# EAGLE schematic openSX70-dongle-USB-V2 (EAGLE 9.2.0)
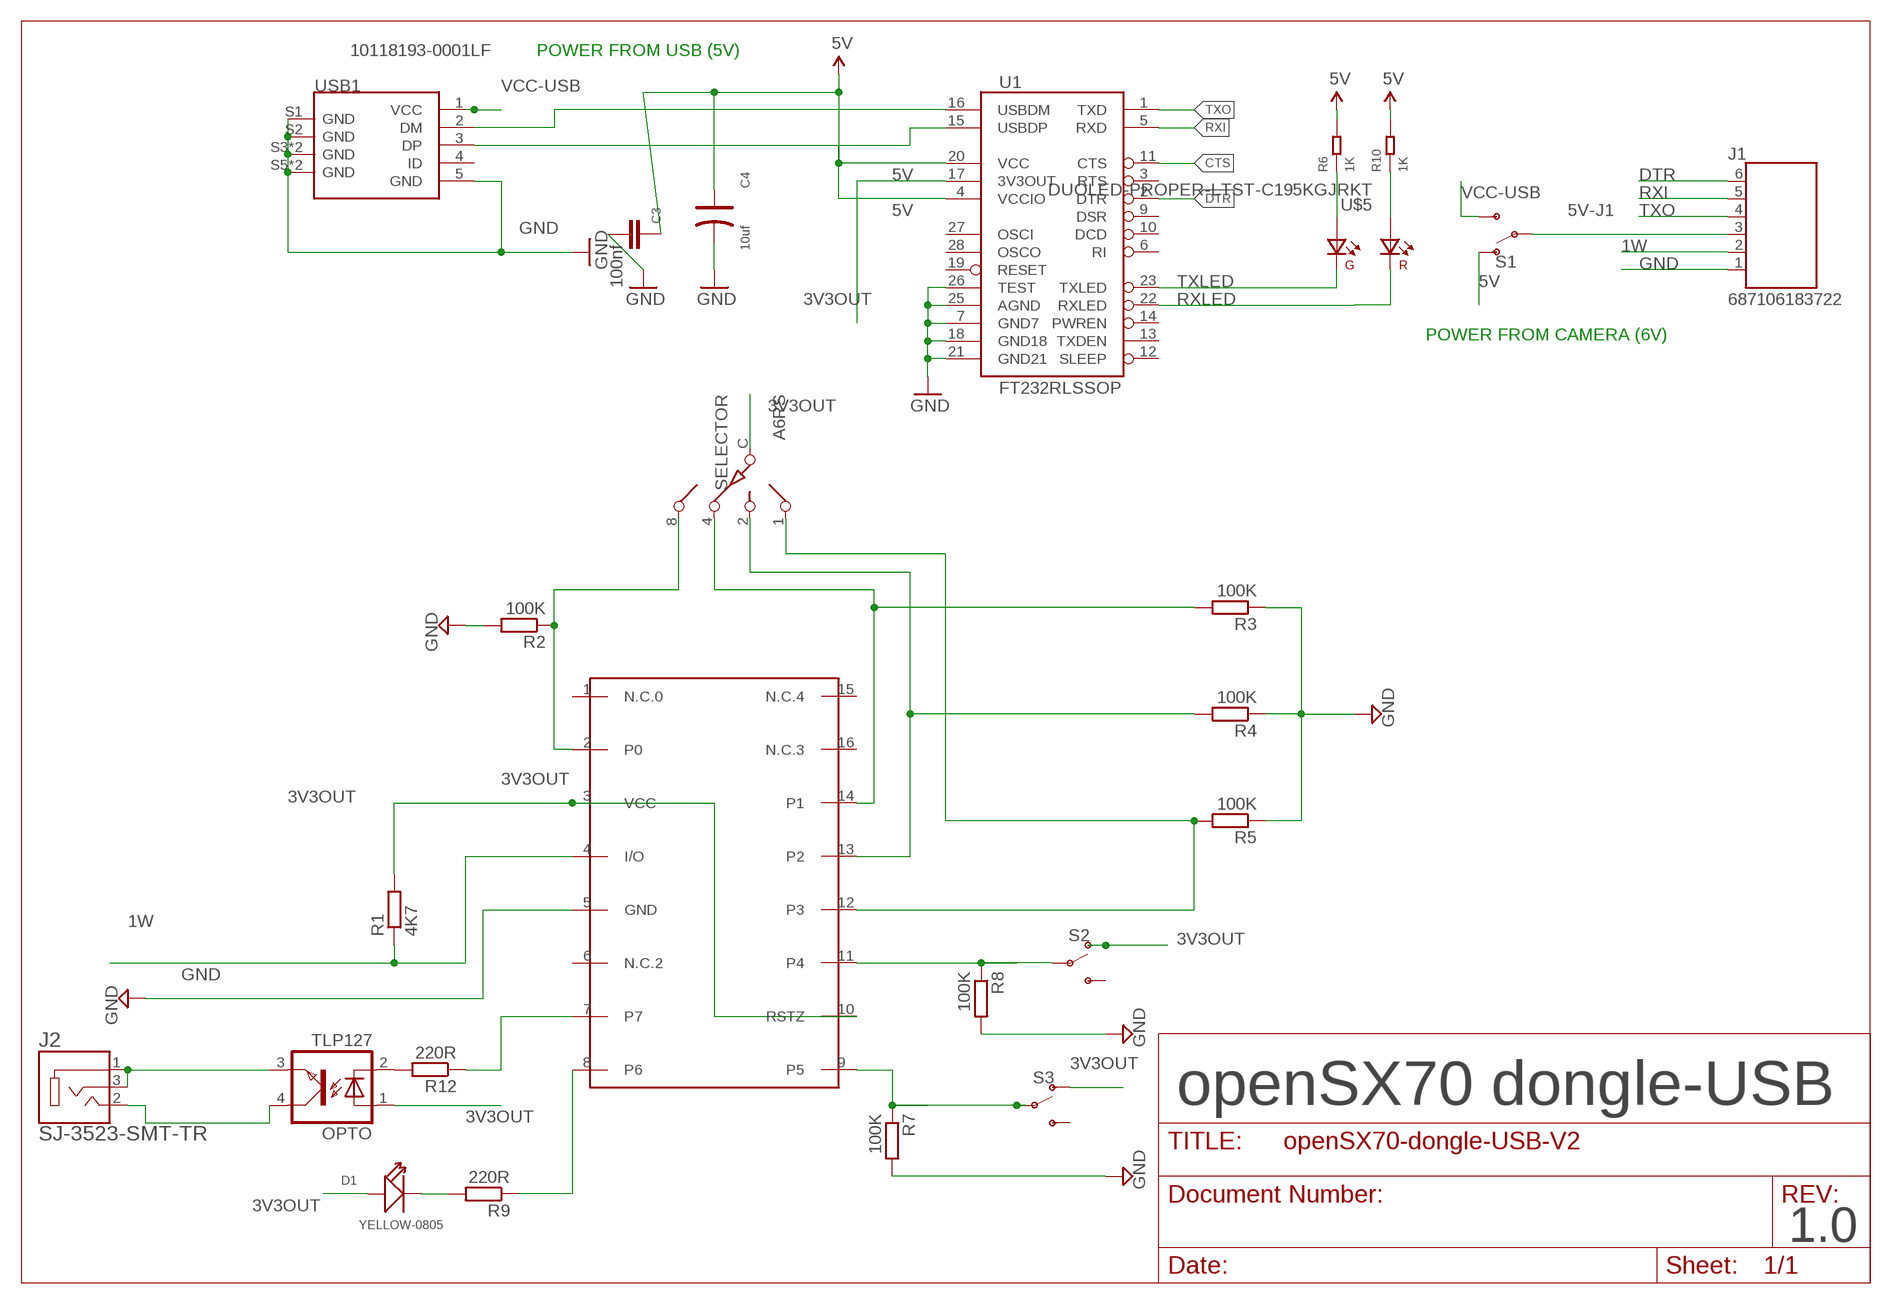
[diagram p0: schematic, sheet 1]

## Parts
C3  100nf  C-EUC0603  [C0603]
C4  10uf  TANTALUM-SMD-10UF-16V-10%(AVX-A)  [AVX-A]
D1  YELLOW-0805  SMD-LED-CLEAR-YELLOW(0805)  [LED-0805]
DS2408  DS2408  [SO16]
J1  687106183722  [687106183722]
J2  SJ-3523-SMT-TR  [CUI_SJ-3523-SMT-TR]
OPTO  TLP127  [SO-4]
R1  4K7  R-EU_R0603  [R0603]
R2  100K  R-EU_R0603  [R0603]
R3  100K  R-EU_R0603  [R0603]
R4  100K  R-EU_R0603  [R0603]
R5  100K  R-EU_R0603  [R0603]
R6  1K  SMD-RES-1K-1%-1/10W(0603)  [R0603]
R7  100K  R-EU_R0603  [R0603]
R8  100K  R-EU_R0603  [R0603]
R9  220R  R-EU_R0603  [R0603]
R10  1K  SMD-RES-1K-1%-1/10W(0603)  [R0603]
R12  220R  R-EU_R0603  [R0603]
S1  SWITCH-SPDT-SMD-RIGHT-ANGLE  [SWITCH_SPST_SMD_A]
S2  SWITCH-SPDT-SMD-RIGHT-ANGLE  [SWITCH_SPST_SMD_A]
S3  SWITCH-SPDT-SMD-RIGHT-ANGLE  [SWITCH_SPST_SMD_A]
SELECTOR  A6RS  [A6RS-161RS]
U1  FT232RLSSOP  [SSOP28DB]
U$5  DUOLED-PROPER-LTST-C195KGJRKT  [LTST-BILED-15X16]
USB1  10118193-0001LF  MICRO-USB-SMD-B-(10118193-0001LF)  [MICRO-USB5+6P-SMD-0.65-B]

## Nets
1W: DS2408.4(I/O) J1.2 R1.1
3V3OUT: D1.+ DS2408.3(VCC) DS2408.10(RSTZ) OPTO.1(A) R1.2 S2.1(O) S3.1(O) SELECTOR.C U1.17(3V3OUT)
5V: C3.1 C4.+ R6.2 R10.2 S1.1(O) U1.4(VCCIO) U1.20(VCC)
5V-J1: J1.3 S1.2(P)
CTS: U1.11(CTS)
DTR: J1.6 U1.2(DTR)
GND: C3.2 C4.- DS2408.5(GND) J1.1 R2.2 R3.1 R4.1 R5.1 R7.2 R8.2 U1.7(GND7) U1.18(GND18) U1.21(GND21) U1.25(AGND) U1.26(TEST) USB1.5(GND) USB1.S1(GND) USB1.S2(GND) USB1.S3(GND) USB1.S4(GND) USB1.S5(GND) USB1.S6(GND)
N$1: J2.1 J2.3 OPTO.3(EMIT)
N$2: D1.- R9.2
N$3: DS2408.2(P0) R2.1 SELECTOR.8
N$4: DS2408.14(P1) R3.2 SELECTOR.4
N$5: DS2408.13(P2) R4.2 SELECTOR.2
N$6: DS2408.11(P4) R8.1 S2.2(P)
N$7: DS2408.9(P5) R7.1 S3.2(P)
N$8: DS2408.8(P6) R9.1
N$9: R10.1 U$5.P$2(A2)
N$10: OPTO.2(C) R12.2
N$11: DS2408.7 R12.1
N$12: J2.2 OPTO.4(COL)
N$13: DS2408.12(P3) R5.2 SELECTOR.1
N$14: R6.1 U$5.P$1(A1)
N$16: U1.16(USBDM) USB1.2(DM)
RXI: J1.5 U1.5(RXD)
RXLED: U1.22(RXLED) U$5.P$4(K2)
TXLED: U1.23(TXLED) U$5.P$3(K1)
TXO: J1.4 U1.1(TXD)
USB_D+: U1.15(USBDP) USB1.3(DP)
VCC-USB: S1.3(S) USB1.1(VCC)
Unconnected: DS2408.1(N.C.0) DS2408.6(N.C.2) DS2408.15(N.C.4) DS2408.16(N.C.3) S2.3(S) S3.3(S) U1.3(RTS) U1.6(RI) U1.9(DSR) U1.10(DCD) U1.12(SLEEP) U1.13(TXDEN) U1.14(PWREN) U1.19(RESET) U1.27(OSCI) U1.28(OSCO) USB1.4(ID)

## Notes on the sheet
- POWER FROM USB (5V)
- POWER FROM CAMERA (6V)
- openSX70 dongle-USB
- 1.0

## Library data of the parts
C3 = resistor:C-EU: CAPACITOR, European symbol
C4 = Seeed-Capacitor-2016:TANTALUM-SMD-10UF-16V-10%(AVX-A): 302020002; MPN: TAJA106K016RNJ
D1 = Seeed-LED-2016:SMD-LED-CLEAR-YELLOW(0805): 304090039; MPN: 17-215UYC/S530-A3/TR8
DS2408 = DS2408-joaco:DS2408
J1 = openSX70_PATHFINDER_V5.5-SEEED_20180522:687106183722: 687106183722 WR-FPC 0.50mm SMT Horizontal Bottom Contact - Low Profile <http://katalog.we-online.de/media/images/v2/Family_WR-FPC_6871xx183722.jpg> Details see: http://katalog.we-online.de/en/em/FPC_0_5_SMT_ZIF_HORIZONTAL_BOTTOM_CONTACT_LOW_PROFILE_6871xx183722 Created by Yingchun,shan 2016 (C) Wurth Elektronik; AVAILABILITY: Good; DESCRIPTION: CONN FFC BTM 6POS 0.5MM SMD R/A; MF: Wurth Electronics; MP: 687106183722; PACKAGE: None; PRICE: 1.21 USD
J2 = SJ-3523-SMT-TR:SJ-3523-SMT-TR: Audio Jack Connector 3.5 mm Low Profile Surface Mount Stereo Jack, 3 Pin Right-Angle; AVAILABILITY: Unavailable; CUI_PURCHASE_URL: https://www.cui.com/product/interconnect/audio-connectors/3.5-mm-jacks/sj-352x-smt-series?utm_source=snapeda.com&utm_medium=referral&utm_campaign=snapedaBOM; DESCRIPTION: SJ Series 3.5 mm 12 V SMT Right Angle Stereo Audio Jack; MF: CUI Inc.; MP: SJ-3523-SMT-TR; PACKAGE: LGA-10 STMicroelectronics; PRICE: None
OPTO = openSX70:TLP127
R1-R5 R7-R9 R12 = resistor:R-EU_: RESISTOR, European symbol
R6 R10 = openSX70_PATHFINDER_V5.5-SEEED_20180522:SMD-RES-1K-1%-1/10W(0603): 301010298; MPN: RC0603FR-071KL
S1-S3 = SparkFun-Switches:SWITCH-SPDT: Single Pole, Double Throw (SPDT) Switch Single-pole, double-throw (SPDT) switch. Variant Overview SMD-AYZ0202 Surface Mount DPDT Switch <https://www.sparkfun.com/products/597> (COM-00597) Used on e.g. LilyPad Arduino USB - ATmega32U4 Board <https://www.sparkfun.com/products/12049> PTH-11.6X4.0MM SPDT Mini Power Switch <https://www.sparkfun.com/products/102> (COM-00102) Used on e.g. SparkFun Simon Says - Through-Hole Soldering Kit <https://www.sparkfun.com/products/10547> (KIT-10547) PTH-11.6X4.0MM-KIT KIT version of SPDT Mini Power Switch - Simplifies soldering by removing tStop of switch pins - only one side can be soldered. PTH-11.6X4.0MM-LOCK LOCK version of SPDT Mini Power Switch - Offset pins hold switch in place for easier soldering. SMD-RIGHT-ANGLE Surface Mount Right Angle Switch <https://www.sparkfun.com/products/10860> (COM-10860) Used on e.g. SparkFun ESP8266 Thing <https://www.sparkfun.com/products/13231>; PROD_ID: SWCH-10651; SF_SKU: COM-10860
SELECTOR = _openSX70:A6RS
U1 = SparkFun:FT232RL: USB UART FT232RL 4th Generation USB UART (USB <-> Serial) Controller. Spark Fun Electronics SKU : COM-00650
U$5 = _openSX70:DUOLED-PROPER-LTST-C195KGJRKT; AVAILABILITY: Unavailable; DESCRIPTION: Green/Red 130° Water Clear 35/25 mcd 2 V 0605 Surface Mount Bi-Color LED; MF: Lite-On Inc.; MP: LTST-C195KGJRKT; PACKAGE: 0606 Lite-On; PRICE: None
USB1 = Seeed-Connector -2016:MICRO-USB-SMD-B-(10118193-0001LF): 320010003; MPN: 10118193-0001LF

## Net classes
0 GND: width 0.203 mm
1 power: width 0.203 mm
2 2.8V: width 0.203 mm